# EAGLE design PCA9540BD_small_breakout (EAGLE 7.3.0)
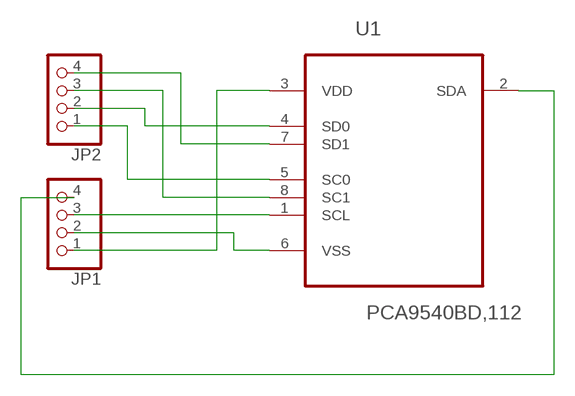
[diagram p0: schematic, sheet 1]

## Parts
JP1  PINHD-1X4  [1X04]
JP2  PINHD-1X4  [1X04]
U1  PCA9540BD,112  [SOIC127P600X175-8N]

## Nets
N$1: JP1.1 U1.3(VDD)
N$2: JP1.2 U1.6(VSS)
N$3: JP1.3 U1.1(SCL)
N$4: JP1.4 U1.2(SDA)
N$5: JP2.1 U1.5(SC0)
N$6: JP2.2 U1.4(SD0)
N$7: JP2.3 U1.8(SC1)
N$8: JP2.4 U1.7(SD1)

## Library data of the parts
JP1 JP2 = pinhead:PINHD-1X4: PIN HEADER
U1 = NXP_By_element14_Batch_1:PCA9540BD,112: 2-channel I2C-bus multiplexer; MPN: PCA9540BD,112; OC_FARNELL: 1831206; OC_NEWARK: 70R6561; PACKAGE: SOIC-8; SUPPLIER: NXP

## Board
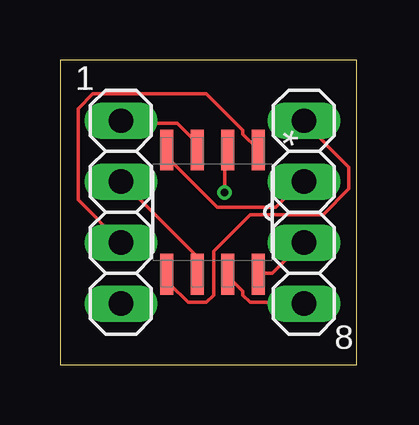
[diagram p1: board, top side]
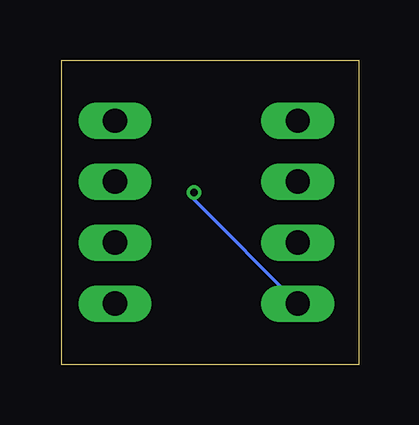
[diagram p2: board, bottom side, seen from below]

Size 12.37 x 12.69 mm. Coordinates in mm from the lower left corner, seen from the top.
Outline: 0,0 12.37,0 12.37,12.69 0,12.69 0,0
Copper layers (1*16): Top 0.035mm / dielectric 1.5mm / Bottom 0.035mm
Design rules "SeeedStudio_2layer_DRU_no_angle_20140221": minimum track width 6mil, minimum drill 12mil, track to track 6mil, track to pad 6mil, pad to pad 6mil, via to via 6mil, smd to smd 0mil, copper to edge 10mil, drill to drill 10mil, minimum pad ring 10mil, minimum via ring 6mil, stop-mask expansion 2mil, vias tented up to drill 100mil, thermal gap 10mil

### Footprints (pad centres in the part's own frame; a part is rotated, then mirrored left to right if it is on the bottom)
1X04 = drill 1.016 long: 1 -3.81,0; 2 -1.27,0; 3 1.27,0; 4 3.81,0
SOIC127P600X175-8N = smd 1.702 x 0.533: 1 -2.591,1.905; 2 -2.591,0.635; 3 -2.591,-0.635; 4 -2.591,-1.905; 5 2.591,-1.905; 6 2.591,-0.635; 7 2.591,0.635; 8 2.591,1.905

### Placement (x,y rotation side)
JP1  2.54,6.35 270 top
JP2  10.16,6.35 270 top
U1  6.35,6.35 270 top

### Tracks (layer width: path | path; a pad name or v marks a point on that pad's centre or on a via)
N$1
  Top 0.152: U1.3 5.64,8.99 5.64,9.3 4.88,10.06 2.59,10.06 JP1.1
N$2
  Top 0.152: U1.6 5.64,3.81 5.64,4.57 2.59,7.62 JP1.2
N$3
  Top 0.152: JP1.3 0.76,6.86 0.76,10.67 1.37,11.28 6.1,11.28 7.62,9.75 7.62,9.6 8.23,8.99 U1.1
N$4  (via drill 0.3)
  Top 0.152: v6.86,7.16 6.86,8.84 U1.2
  Bottom 0.152: v6.86,7.16 6.86,6.86 JP1.4
N$5
  Top 0.152: U1.5 4.57,3.66 4.57,3.35 5.33,2.59 6.1,2.59 6.4,2.9 6.4,4.72 7.92,6.25 10.97,6.25 12.04,7.32 12.04,8.23 10.21,10.06 JP2.1
N$6
  Top 0.152: U1.4 4.57,8.84 4.57,8.53 6.55,6.55 8.99,6.55 10.06,7.62 JP2.2
N$7
  Top 0.152: U1.8 8.38,3.81 8.84,3.81 10.06,5.03 JP2.3
N$8
  Top 0.152: U1.7 7.01,3.66 7.62,3.05 7.62,2.9 7.92,2.59 10.06,2.59 JP2.4

### Text on the board
tNames: 1 | 8